# EAGLE design Pot_panel_v1.00_print (EAGLE 8.1.0)
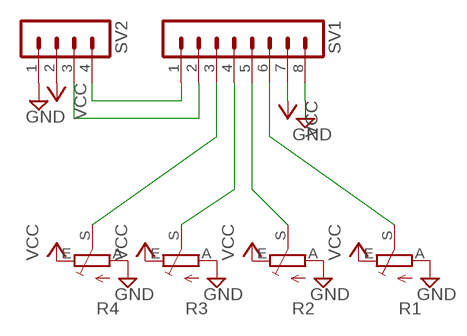
[diagram p0: schematic, sheet 1]

## Parts
R1  TRIM_EU-CA6V  [CA6V]
R2  TRIM_EU-CA6V  [CA6V]
R3  TRIM_EU-CA6V  [CA6V]
R4  TRIM_EU-CA6V  [CA6V]
SV1  MA08-1  [MA08-1]
SV2  MA04-1  [MA04-1]

## Nets
A0: R1.S SV1.6
A1: R2.S SV1.5
A2: R3.S SV1.4
A3: R4.S SV1.3
GND: R1.A R2.A R3.A R4.A SV1.8 SV2.1
IO1: SV1.1 SV2.4
IO2: SV1.2 SV2.3
VCC: R1.E R2.E R3.E R4.E SV1.7 SV2.2

## Library data of the parts
R1-R4 = pot:TRIM_EU-: POTENTIOMETER
SV1 = con-lstb:MA08-1: PIN HEADER; OC_FARNELL: unknown; OC_NEWARK: unknown
SV2 = con-lstb:MA04-1: PIN HEADER; OC_FARNELL: unknown; OC_NEWARK: unknown

## Board
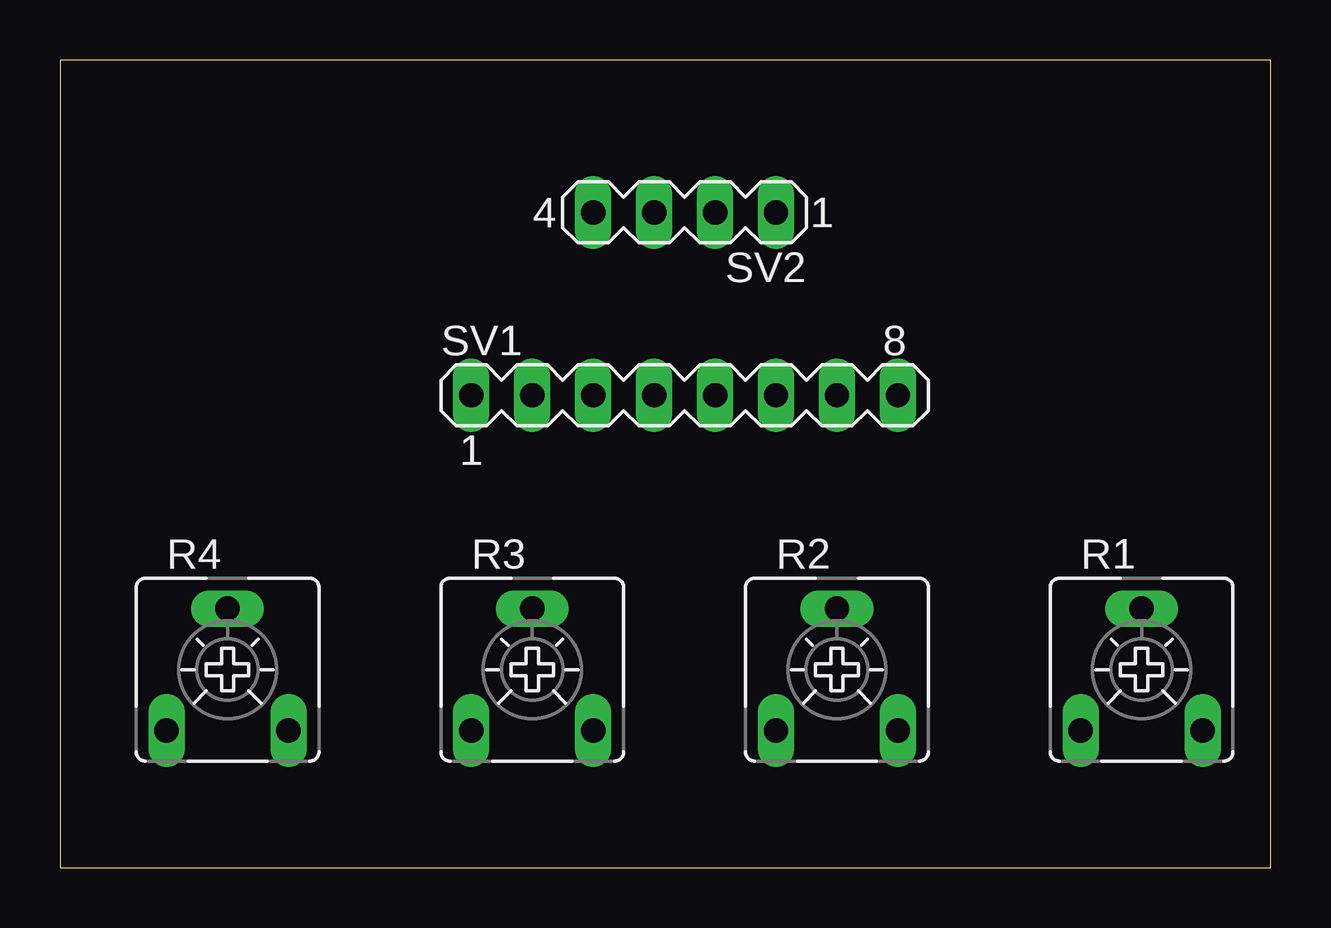
[diagram p1: board, top side]
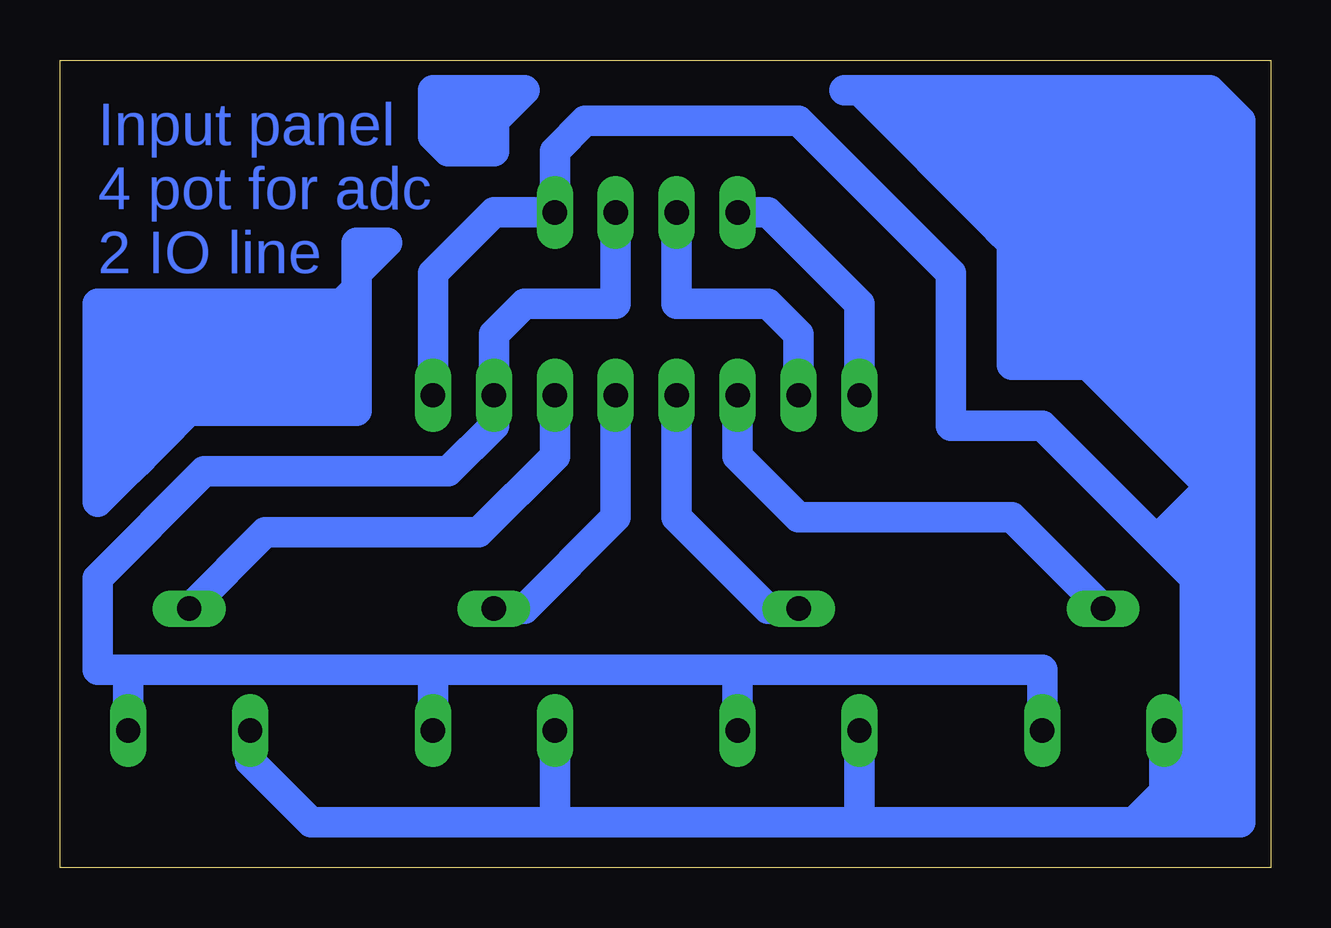
[diagram p2: board, bottom side, seen from below]

Size 50.47 x 33.65 mm. Coordinates in mm from the lower left corner, seen from the top.
Outline: 0,0 50.47,0 50.47,33.65 0,33.65 0,0
Copper layers (1*16): Top 0.035mm / dielectric 1.5mm / Bottom 0.035mm
Design rules "default": minimum track width 10mil, minimum drill 24mil, track to track 8mil, track to pad 8mil, pad to pad 8mil, via to via 8mil, smd to smd 8mil, copper to edge 40mil, drill to drill 8mil, minimum pad ring 10mil, minimum via ring 8mil, stop-mask expansion 4mil, vias tented up to drill 0mil, thermal gap 10mil

### Footprints (pad centres in the part's own frame; a part is rotated, then mirrored left to right if it is on the bottom)
CA6V = drill 1.016 long: A -2.54,-2.54; E 2.54,-2.54; S 0,2.54
MA08-1 = drill 1.016 long: 1 -8.89,0; 2 -6.35,0; 3 -3.81,0; 4 -1.27,0; 5 1.27,0; 6 3.81,0; 7 6.35,0; 8 8.89,0
MA04-1 = drill 1.016 long: 1 -3.81,0; 2 -1.27,0; 3 1.27,0; 4 3.81,0

### Placement (x,y rotation side)
R1  45.09,8.26 0 top
R2  32.38,8.26 0 top
R3  19.68,8.26 0 top
R4  6.99,8.26 0 top
SV1  26.04,19.68 0 top
SV2  26.04,27.3 180 top

### Tracks (layer width: path | path; a pad name or v marks a point on that pad's centre or on a via)
A0
  Bottom 1.27: SV1.6 29.84,17.14 33.02,13.97 41.91,13.97 R1.S
A1
  Bottom 1.27: SV1.5 27.3,14.61 31.11,10.79 R2.S
A2
  Bottom 1.27: R3.S 20.95,10.79 24.77,14.61 SV1.4
A3
  Bottom 1.27: SV1.3 22.23,17.14 19.68,14.61 10.79,14.61 R4.S
GND
  Bottom 1.27: SV1.8 34.92,24.77 32.38,27.3 SV2.1 29.84,29.84 28.57,31.11 19.68,31.11 13.34,24.77 13.34,18.41 9.53,18.41 3.17,12.06 3.17,5.71 | R1.A 42.55,4.45 40.01,1.91 29.84,1.91 | 29.84,1.91 17.14,1.91 | 17.14,1.91 5.71,1.91 | 5.71,1.91 4.45,3.17 R4.A 3.81,5.71 | R3.A 17.14,1.91 | R2.A 29.84,1.91 | 3.81,5.71 3.17,5.71 | 5.71,1.91 4.45,1.91 | 2.54,1.91 1.27,1.91 1.27,5.08 | 17.78,32.38 17.14,32.38 | 17.14,32.38 2.54,32.38 1.27,31.11 1.27,14.61 | 1.27,14.61 2.54,15.88 | 2.54,15.88 7.62,20.95 10.79,20.95 10.79,25.4 | 10.79,26.04 10.79,26.67 11.43,26.67 | 11.43,26.67 17.14,32.38 | 11.43,26.67 10.79,26.04 | 10.79,26.04 10.79,25.4 | 10.79,25.4 6.99,21.59 10.16,21.59 10.16,23.5 | 10.16,24.13 10.16,23.5 | 10.16,23.5 8.89,22.23 7.62,22.23 1.91,16.51 1.91,17.78 | 1.91,19.05 1.91,29.84 | 1.91,29.84 1.91,31.11 2.54,31.75 10.79,31.75 | 12.06,31.75 13.34,31.75 | 14.61,31.75 15.24,31.75 15.24,31.11 1.91,17.78 | 1.91,17.78 1.91,19.05 | 1.91,19.05 14.61,31.75 | 14.61,31.75 13.34,31.75 | 13.34,31.75 2.54,20.95 2.54,22.23 12.06,31.75 | 12.06,31.75 10.79,31.75 | 10.79,31.75 2.54,23.5 2.54,24.77 8.89,31.11 7.62,31.11 2.54,26.04 2.54,27.3 6.35,31.11 5.08,31.11 2.54,28.57 2.54,29.21 4.45,31.11 3.17,31.11 1.91,29.84 | 1.91,29.84 3.17,29.84 7.62,25.4 | 1.27,14.61 1.27,5.08 | 1.27,5.08 1.91,4.45 | 1.91,4.45 4.45,1.91 | 4.45,1.91 2.54,1.91 | 2.54,1.91 1.91,2.54 1.91,3.81 | 1.91,4.45 1.91,3.81 | 1.91,3.81 3.17,2.54 3.17,5.08 3.81,5.71 | 3.17,5.71 2.54,5.71 1.91,5.08 2.54,4.45 2.54,13.97 | 2.54,15.24 2.54,13.97 | 2.54,13.97 3.17,13.34 3.17,10.16 1.91,8.89 | 3.81,13.97 3.81,14.61 | 3.81,14.61 2.54,15.88 | 3.81,14.61 4.45,13.97
IO1
  Bottom 1.27: SV1.1 17.14,23.5 20.95,27.3 SV2.4
IO2
  Bottom 1.27: SV2.3 24.77,23.5 20.95,23.5 19.68,22.23 SV1.2
N$3
  Bottom 1.27: 48.26,20.95 48.26,16.51 47.62,16.51 | 47.62,16.51 46.99,17.14 | 46.99,17.14 44.45,19.68 44.45,19.05 38.1,19.05 38.1,24.13 | 38.1,24.13 39.37,22.86 48.26,22.86 48.9,23.5 48.9,15.24 47.62,16.51 | 46.99,17.14 46.99,18.41 47.62,19.05 47.62,16.51 | 38.1,24.13 38.1,24.77 | 38.1,24.77 38.1,26.04 36.83,26.04 38.1,24.77
N$4
  Bottom 1.27: 34.92,30.48 34.92,31.75 | 34.92,31.75 34.92,32.38 31.11,32.38 32.38,31.11 32.38,29.84 34.29,29.84 34.92,30.48 | 34.92,30.48 33.66,30.48 33.02,31.11 34.29,31.11 34.92,31.75 | 34.92,31.75 32.38,31.75
VCC
  Bottom 1.27: SV2.2 27.3,23.5 31.11,23.5 32.38,22.23 SV1.7 32.38,18.41 34.29,16.51 44.45,16.51 48.9,12.06 48.9,8.26 47.62,8.26 | 34.92,8.26 47.62,8.26 | 47.62,8.26 R1.E | 22.23,8.26 34.92,8.26 | 22.23,8.26 9.53,8.26 R4.E | R3.E 22.23,8.26 | R2.E 34.92,8.26
(copper drawn outside any net)
  shapes: Bottom area x1

### Text on the board
Bottom: Input panel / 4 pot for adc / 2 IO line